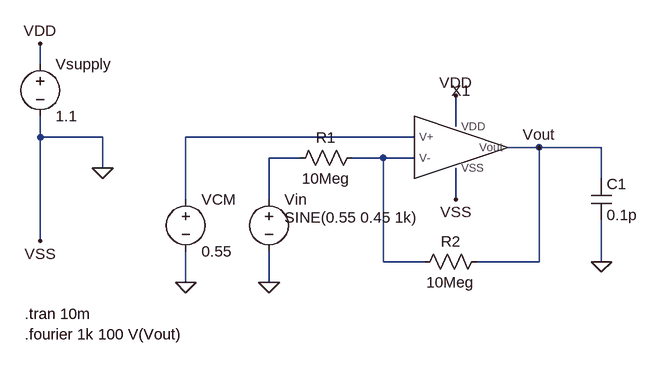
[diagram p0: schematic SIM_fourier.asc]
SIM_fourier.asc, the LTspice schematic file:
Version 4
SHEET 1 880 680
WIRE -416 64 -416 32
WIRE 224 160 224 112
WIRE -416 176 -416 144
WIRE -320 176 -416 176
WIRE 160 176 -192 176
WIRE 352 192 304 192
WIRE 448 192 352 192
WIRE -16 208 -64 208
WIRE 112 208 64 208
WIRE 160 208 112 208
WIRE -320 224 -320 176
WIRE 448 240 448 192
WIRE -192 272 -192 176
WIRE -64 272 -64 208
WIRE 224 272 224 224
WIRE -416 336 -416 176
WIRE 112 368 112 208
WIRE 176 368 112 368
WIRE 352 368 352 192
WIRE 352 368 256 368
WIRE 448 368 448 304
WIRE -192 400 -192 352
WIRE -64 400 -64 352
FLAG -320 224 0
FLAG 224 112 VDD
FLAG -416 32 VDD
FLAG 224 272 VSS
FLAG -416 336 VSS
FLAG -64 400 0
FLAG -192 400 0
FLAG 448 368 0
FLAG 352 192 Vout
SYMBOL voltage -416 48 R0
WINDOW 123 0 0 Left 0
WINDOW 39 0 0 Left 0
SYMATTR InstName Vsupply
SYMATTR Value 1.1
SYMBOL voltage -64 256 R0
WINDOW 3 24 44 Left 2
WINDOW 123 0 0 Left 0
WINDOW 39 0 0 Left 0
SYMATTR Value SINE(0.55 0.45 1k)
SYMATTR InstName Vin
SYMBOL voltage -192 256 R0
WINDOW 123 0 0 Left 0
WINDOW 39 0 0 Left 0
SYMATTR InstName VCM
SYMATTR Value 0.55
SYMBOL res 80 192 R90
WINDOW 0 0 56 VBottom 2
WINDOW 3 32 56 VTop 2
SYMATTR InstName R1
SYMATTR Value 10Meg
SYMBOL res 272 352 R90
WINDOW 0 0 56 VBottom 2
WINDOW 3 32 56 VTop 2
SYMATTR InstName R2
SYMATTR Value 10Meg
SYMBOL cap 432 240 R0
SYMATTR InstName C1
SYMATTR Value 0.1p
SYMBOL OpAmp_V1 224 192 R0
SYMATTR InstName X1
TEXT -440 448 Left 2 !.tran 10m
TEXT -440 480 Left 2 !.fourier 1k 100 V(Vout)

The netlist it stands for:
* SIM_fourier.asc
Vsupply VDD 0 1.1
Vin N002 0 SINE(0.55 0.45 1k)
VCM N001 0 0.55
R1 N003 N002 10Meg
R2 Vout N003 10Meg
C1 Vout 0 0.1p
XX1 N001 N003 VDD 0 Vout OpAmp_V1  ; pins V+ V- VDD VSS Vout
.tran 10m
.fourier 1k 100 V(Vout)
.backanno
.end